# Altium schematic sheet PCIE_Connector.SchDoc: PCI Express GEN3  X 8 Connector
size B; DocumentNumber: 11; SheetNumber: 11; SheetTotal: 46
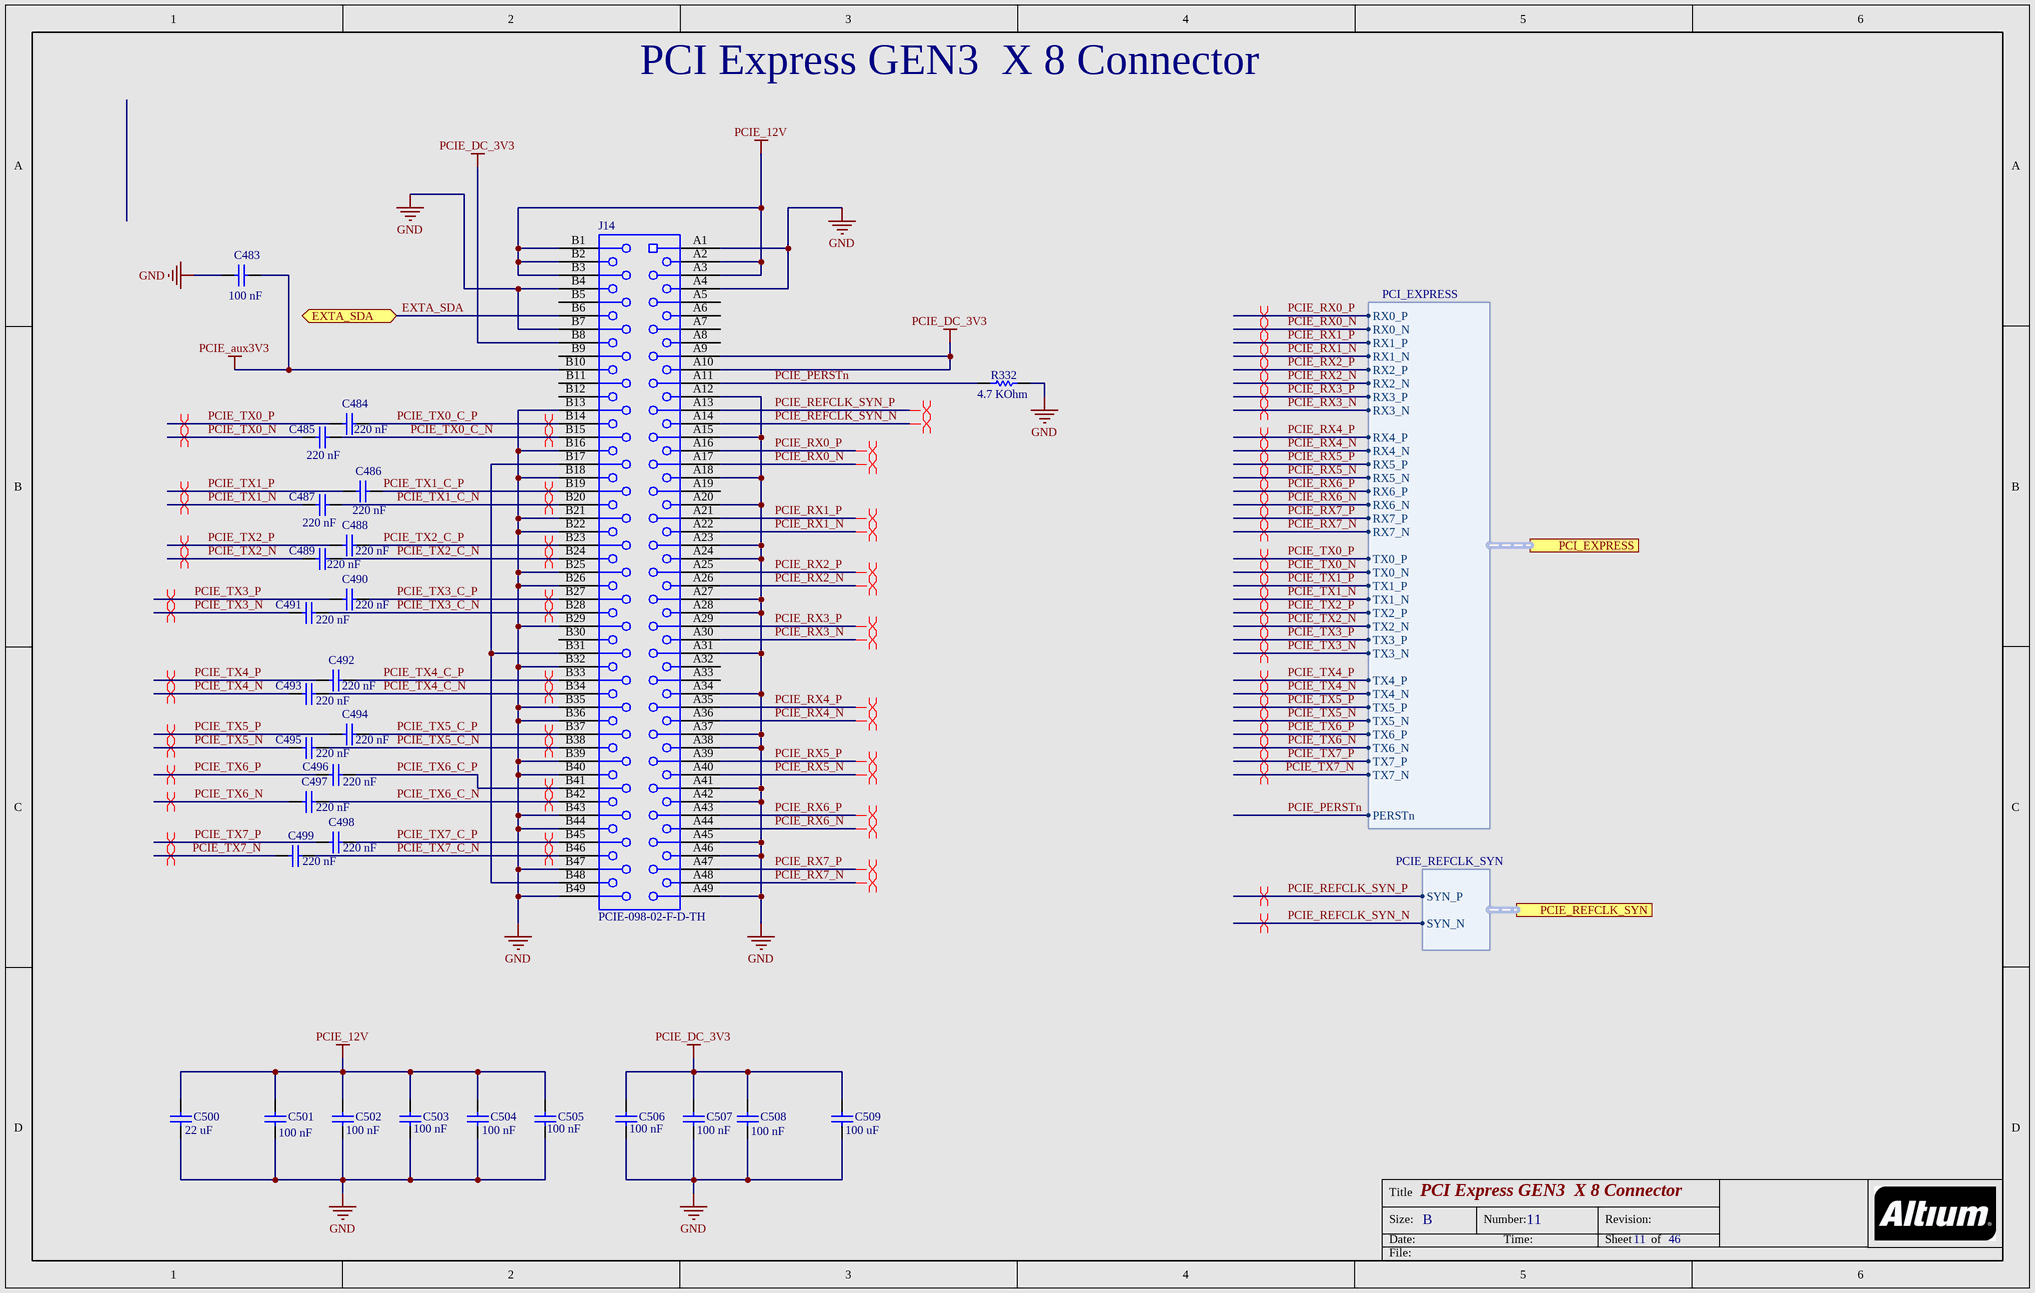
[diagram p0: PCIE_Connector.SchDoc]

## Parts
C483  Capacitance: 100 nF  [CAPC1005X55X10LL05]  (hidden comment: C1005X7R1E104M)
C484  Capacitance: 220 nF  [CAPC1005X55X25NL05T10]  (hidden comment: GRM155R61A224KE19D)
C485  Capacitance: 220 nF  [CAPC1005X55X25NL05T10]  (hidden comment: GRM155R61A224KE19D)
C486  Capacitance: 220 nF  [CAPC1005X55X25NL05T10]  (hidden comment: GRM155R61A224KE19D)
C487  Capacitance: 220 nF  [CAPC1005X55X25NL05T10]  (hidden comment: GRM155R61A224KE19D)
C488  Capacitance: 220 nF  [CAPC1005X55X25NL05T10]  (hidden comment: GRM155R61A224KE19D)
C489  Capacitance: 220 nF  [CAPC1005X55X25NL05T10]  (hidden comment: GRM155R61A224KE19D)
C490  Capacitance: 220 nF  [CAPC1005X55X25NL05T10]  (hidden comment: GRM155R61A224KE19D)
C491  Capacitance: 220 nF  [CAPC1005X55X25NL05T10]  (hidden comment: GRM155R61A224KE19D)
C492  Capacitance: 220 nF  [CAPC1005X55X25NL05T10]  (hidden comment: GRM155R61A224KE19D)
C493  Capacitance: 220 nF  [CAPC1005X55X25NL05T10]  (hidden comment: GRM155R61A224KE19D)
C494  Capacitance: 220 nF  [CAPC1005X55X25NL05T10]  (hidden comment: GRM155R61A224KE19D)
C495  Capacitance: 220 nF  [CAPC1005X55X25NL05T10]  (hidden comment: GRM155R61A224KE19D)
C496  Capacitance: 220 nF  [CAPC1005X55X25NL05T10]  (hidden comment: GRM155R61A224KE19D)
C497  Capacitance: 220 nF  [CAPC1005X55X25NL05T10]  (hidden comment: GRM155R61A224KE19D)
C498  Capacitance: 220 nF  [CAPC1005X55X25NL05T10]  (hidden comment: GRM155R61A224KE19D)
C499  Capacitance: 220 nF  [CAPC1005X55X25NL05T10]  (hidden comment: GRM155R61A224KE19D)
C500  Capacitance: 22 uF  [CAPC3216X180X55ML20T25]  (hidden comment: GRM31CR61E226KE15L)
C501  Capacitance: 100 nF  [CAPC1005X55X10LL05]  (hidden comment: C1005X7R1E104M)
C502  Capacitance: 100 nF  [CAPC1005X55X10LL05]  (hidden comment: C1005X7R1E104M)
C503  Capacitance: 100 nF  [CAPC1005X55X10LL05]  (hidden comment: C1005X7R1E104M)
C504  Capacitance: 100 nF  [CAPC1005X55X10LL05]  (hidden comment: C1005X7R1E104M)
C505  Capacitance: 100 nF  [CAPC1005X55X10LL05]  (hidden comment: C1005X7R1E104M)
C506  Capacitance: 100 nF  [CAPC1005X55X10LL05]  (hidden comment: C1005X7R1E104M)
C507  Capacitance: 100 nF  [CAPC1005X55X10LL05]  (hidden comment: C1005X7R1E104M)
C508  Capacitance: 100 nF  [CAPC1005X55X10LL05]  (hidden comment: C1005X7R1E104M)
C509  Capacitance: 100 uF  [CAPC3216X190X55ML30T25]  (hidden comment: GRM31CR60J107ME39L)
J14  PCIE-098-02-F-D-TH  [SMTC-PCIE-098-02-F-D-TH_V]
R332  Resistance: 4.7 KOhm  [RESC1005X40X25LL05T05]  (hidden comment: ERJ-2RKF4701X)

## Ports
EXTA_SDA (bidir), PCI_EXPRESS (harness PCI_EXPRESS), PCIE_REFCLK_SYN (harness PCIE_REFCLK_SYN)

## Harnesses
PCI_EXPRESS: RX0_P, RX0_N, RX1_P, RX1_N, RX2_P, RX2_N, RX3_P, RX3_N, RX7_N, RX7_P, RX4_P, RX4_N, RX5_P, RX5_N, RX6_P, RX6_N, TX0_P, TX0_N, TX1_P, TX1_N, TX2_P, TX2_N, TX3_P, TX3_N, TX7_N, TX7_P, TX4_P, TX4_N, TX5_P, TX5_N, TX6_P, TX6_N, PERSTn
PCIE_REFCLK_SYN: SYN_P, SYN_N

## Nets
GND: C483.1 C500.1 C501.1 C502.1 C503.1 C504.1 C505.1 C506.1 C507.1 C508.1 C509.1 J14.A1 J14.A4 J14.A12 J14.A15 J14.A18 J14.A20 J14.A23 J14.A24 J14.A27 J14.A28 J14.A31 J14.A34 J14.A37 J14.A38 J14.A41 J14.A42 J14.A45 J14.A46 J14.A49 J14.B4 J14.B7 J14.B13 J14.B16 J14.B18 J14.B21 J14.B22 J14.B25 J14.B26 J14.B29 J14.B32 J14.B35 J14.B36 J14.B39 J14.B40 J14.B43 J14.B44 J14.B47 J14.B49 R332.2
PCIE_12V: C500.2 C501.2 C502.2 C503.2 C504.2 C505.2 J14.A2 J14.A3 J14.B1 J14.B2 J14.B3
PCIE_aux3V3: C483.2 J14.B10
PCIE_DC_3V3: C506.2 C507.2 C508.2 C509.2 J14.A9 J14.A10 J14.B8
EXTA_SDA: J14.B6 ; port EXTA_SDA
PCIE_PERSTn: J14.A11 R332.1 ; port PCI_EXPRESS.PERSTn
PCIE_REFCLK_SYN_N: J14.A14 ; port PCIE_REFCLK_SYN.SYN_N
PCIE_REFCLK_SYN_P: J14.A13 ; port PCIE_REFCLK_SYN.SYN_P
PCIE_RX0_N: J14.A17 ; port PCI_EXPRESS.RX0_N
PCIE_RX0_P: J14.A16 ; port PCI_EXPRESS.RX0_P
PCIE_RX1_N: J14.A22 ; port PCI_EXPRESS.RX1_N
PCIE_RX1_P: J14.A21 ; port PCI_EXPRESS.RX1_P
PCIE_RX2_N: J14.A26 ; port PCI_EXPRESS.RX2_N
PCIE_RX2_P: J14.A25 ; port PCI_EXPRESS.RX2_P
PCIE_RX3_N: J14.A30 ; port PCI_EXPRESS.RX3_N
PCIE_RX3_P: J14.A29 ; port PCI_EXPRESS.RX3_P
PCIE_RX4_N: J14.A36 ; port PCI_EXPRESS.RX4_N
PCIE_RX4_P: J14.A35 ; port PCI_EXPRESS.RX4_P
PCIE_RX5_N: J14.A40 ; port PCI_EXPRESS.RX5_N
PCIE_RX5_P: J14.A39 ; port PCI_EXPRESS.RX5_P
PCIE_RX6_N: J14.A44 ; port PCI_EXPRESS.RX6_N
PCIE_RX6_P: J14.A43 ; port PCI_EXPRESS.RX6_P
PCIE_RX7_N: J14.A48 ; port PCI_EXPRESS.RX7_N
PCIE_RX7_P: J14.A47 ; port PCI_EXPRESS.RX7_P
PCIE_TX0_C_N: C485.2 J14.B15
PCIE_TX0_C_P: C484.2 J14.B14
PCIE_TX0_N: C485.1 ; port PCI_EXPRESS.TX0_N
PCIE_TX0_P: C484.1 ; port PCI_EXPRESS.TX0_P
PCIE_TX1_C_N: C487.2 J14.B20
PCIE_TX1_C_P: C486.2 J14.B19
PCIE_TX1_N: C487.1 ; port PCI_EXPRESS.TX1_N
PCIE_TX1_P: C486.1 ; port PCI_EXPRESS.TX1_P
PCIE_TX2_C_N: C489.2 J14.B24
PCIE_TX2_C_P: C488.2 J14.B23
PCIE_TX2_N: C489.1 ; port PCI_EXPRESS.TX2_N
PCIE_TX2_P: C488.1 ; port PCI_EXPRESS.TX2_P
PCIE_TX3_C_N: C491.2 J14.B28
PCIE_TX3_C_P: C490.2 J14.B27
PCIE_TX3_N: C491.1 ; port PCI_EXPRESS.TX3_N
PCIE_TX3_P: C490.1 ; port PCI_EXPRESS.TX3_P
PCIE_TX4_C_N: C493.2 J14.B34
PCIE_TX4_C_P: C492.2 J14.B33
PCIE_TX4_N: C493.1 ; port PCI_EXPRESS.TX4_N
PCIE_TX4_P: C492.1 ; port PCI_EXPRESS.TX4_P
PCIE_TX5_C_N: C495.2 J14.B38
PCIE_TX5_C_P: C494.2 J14.B37
PCIE_TX5_N: C495.1 ; port PCI_EXPRESS.TX5_N
PCIE_TX5_P: C494.1 ; port PCI_EXPRESS.TX5_P
PCIE_TX6_C_N: C497.2 J14.B42
PCIE_TX6_C_P: C496.2 J14.B41
PCIE_TX6_N: C497.1 ; port PCI_EXPRESS.TX6_N
PCIE_TX6_P: C496.1 ; port PCI_EXPRESS.TX6_P
PCIE_TX7_C_N: C499.2 J14.B46
PCIE_TX7_C_P: C498.2 J14.B45
PCIE_TX7_N: C499.1 ; port PCI_EXPRESS.TX7_N
PCIE_TX7_P: C498.1 ; port PCI_EXPRESS.TX7_P
NetJ14_B17: J14.B17 J14.B31 J14.B48

Not connected (* = marked no-connect by the designer): J14 A5 A6 A7 A8 A19 A32 A33 B5 B9 B11 B12 B30

## Layout directives
differential pair: PCIE_REFCLK_SYN_N, PCIE_REFCLK_SYN_P, PCIE_RX0_N, PCIE_RX0_P, PCIE_RX1_N, PCIE_RX1_P, PCIE_RX2_N, PCIE_RX2_P, PCIE_RX3_N, PCIE_RX3_P, PCIE_RX4_N, PCIE_RX4_P, PCIE_RX5_N, PCIE_RX5_P, PCIE_RX6_N, PCIE_RX6_P, PCIE_RX7_N, PCIE_RX7_P, PCIE_TX0_C_N, PCIE_TX0_C_P, PCIE_TX0_N, PCIE_TX0_P, PCIE_TX1_C_N, PCIE_TX1_C_P, PCIE_TX1_N, PCIE_TX1_P, PCIE_TX2_C_N, PCIE_TX2_C_P, PCIE_TX2_N, PCIE_TX2_P, PCIE_TX3_C_N, PCIE_TX3_C_P, PCIE_TX3_N, PCIE_TX3_P, PCIE_TX4_C_N, PCIE_TX4_C_P, PCIE_TX4_N, PCIE_TX4_P, PCIE_TX5_C_N, PCIE_TX5_C_P, PCIE_TX5_N, PCIE_TX5_P, PCIE_TX6_C_N, PCIE_TX6_C_P, PCIE_TX6_N, PCIE_TX6_P, PCIE_TX7_C_N, PCIE_TX7_C_P, PCIE_TX7_N, PCIE_TX7_P

## Notes on the sheet
- Title
- Size:
- Date:
- B
- Number:
- Time:
- Revision:
- Sheet
- of
- File:

## Library data of the parts
C483 C501-C508 = CMP-1663-00009-2: Chip Capacitor, 0.1 uF, +/- 20%, 25 V, -55 to 125 degC, 0402 (1005 Metric), RoHS, Tape and Reel; Type (Capacitors): X7R; Voltage Rating: 25 V; Case\/Package: 0402; Tolerance: 20%; Max Operating Temperature: 125 degC; ComponentLink2URL: http://www.farnell.com/datasheets/1571323.pdf; ComponentLink1URL: http://www.tdk.com/; RoHSCompliant: true; Packaging: Tape and Reel; Mounting Technology: Surface Mount; ComponentLink2Description: Datasheet; Case Code (Imperial): 0402; DatasheetVersion: 09/2011; ComponentLink1Description: Manufacturer URL; PackageDescription: 2-Pin Surface Mount Device, Body 1 x 0.5 mm; PackageReference: 0402; Min Operating Temperature: -55 degC; Case Code (Metric): 1005; Height: 0.5 mm; Package Quantity: 10000; Width: 0.5 mm; Pins: 2; Voltage Rating (DC): 25 V; PartNumber: C1005X7R1E104M; Mount: Surface Mount; Length: 1 mm
C484-C499 = CMP-2008-04561-4: Chip Capacitor, 220 nF, +/- 10%, 10 V, -55 to 85 degC, 0402 (1005 Metric), RoHS, Tape and Reel; Manufacturer: Basic Passives; Voltage Rating: 10 V; Case\/Package: 0402; Type (Capacitors): X5R; ComponentLink1URL: http://www.murata.com/; Package Quantity: 1; Tolerance: 10%; Mounting Technology: Surface Mount; RoHSCompliant: true; PartNumber: GRM155R61A224KE19D; Max Operating Temperature: 85 degC; Case Code (Imperial): 0402; Length: 1 mm; Packaging: Tape and Reel; Min Operating Temperature: -55 degC; PackageDescription: 2-Pin Surface Mount Device, Body 1 x 0.5 mm; Height: 0.5 mm; Case Code (Metric): 1005; REACH SVHC: No SVHC; ComponentLink1Description: Manufacturer URL; Width: 0.5 mm; ComponentLink2URL: http://search.murata.co.jp/Ceramy/image/img/A01X/G101/ENG/GRM155R61A224KE19-01.pdf; Radiation Hardening: No; Pins: 2; Voltage Rating (DC): 10 V; DatasheetVersion: 03/2016; Mount: Surface Mount; PackageReference: 0402; ComponentLink2Description: Datasheet
C500 = CMP-1662-00010-2: Chip Capacitor, 22 uF, +/- 10%, 25 V, -55 to 85 degC, 1206 (3216 Metric), RoHS, Tape and Reel; Voltage Rating (DC): 25 V; Case\/Package: 1206; Type (Capacitors): X5R; Tolerance: 10%; Max Operating Temperature: 85 degC; Package Quantity: 2000; Voltage Rating: 25 V; Case Code (Metric): 3216; Length: 3.2 mm; PackageDescription: 2-Pin Surface Mount Device, Body 3.2 x 1.6 mm; ComponentLink1Description: Manufacturer URL; Case Code (Imperial): 1206; ComponentLink1URL: http://www.murata.com/; Radiation Hardening: No; Height: 1.6 mm; Width: 1.6 mm; DatasheetVersion: 03/2016; Min Operating Temperature: -55 degC; Mount: Surface Mount; REACH SVHC: No SVHC; PackageReference: 1206; ComponentLink2URL: http://search.murata.co.jp/Ceramy/image/img/A01X/G101/ENG/GRM31CR61E226KE15-01.pdf; Packaging: Tape and Reel; RoHSCompliant: true; ComponentLink2Description: Datasheet; Mounting Technology: Surface Mount; PartNumber: GRM31CR61E226KE15L; Pins: 2
C509 = CMP-1662-00011-2: Chip Capacitor, 100 uF, +/- 20%, 6.3 V, -55 to 85 degC, 1206 (3216 Metric), RoHS, Tape and Reel; Voltage Rating: 6.3 V; Type (Capacitors): X5R; Case\/Package: 1206; Tolerance: 20%; ComponentLink1URL: http://www.murata.com/; ComponentLink1Description: Manufacturer URL; PackageDescription: 2-Pin Surface Mount Device, Body 3.2 x 1.6 mm; Max Operating Temperature: 85 degC; Case Code (Imperial): 1206; PackageReference: 1206; Height: 1.6 mm; Width: 1.6 mm; Packaging: Tape and Reel; DatasheetVersion: 09/2016; REACH SVHC: No SVHC; Mounting Technology: Surface Mount; Case Code (Metric): 3216; Min Operating Temperature: -55 degC; RoHSCompliant: true; Radiation Hardening: No; Voltage Rating (DC): 6.3 V; Package Quantity: 2000; ComponentLink2Description: Datasheet; Mount: Surface Mount; Length: 3.2 mm; ComponentLink2URL: http://psearch.en.murata.com/capacitor/product/GRM31CR60J107ME39%23.pdf; Pins: 2; PartNumber: GRM31CR60J107ME39L
J14 = CMP-1707-00002-1: Female Header, Pitch 1 mm, 98 Positions, 4 Rows, Height 11 mm, Tail Length 2.31 mm, -55 to 125 degC, RoHS; Manufacturer: Samtec; PartNumber: PCIE-098-02-F-D-TH; PackageReference: PCIE-098-02-F-D-TH; ComponentLink3URL: http://suddendocs.samtec.com/prints/pcie-xxx-02-x-d-th-footprint.pdf; PackageDescription: Female Header, Pitch 1 mm, 98 Positions, 4 Rows, Height 11 mm, Tail Length 2.31 mm; ComponentLink2Description: Datasheet; ComponentLink1URL: http://www.samtec.com/; Mounting Technology: Through Hole; DatasheetVersion: Rev. 21JAN16; ComponentLink2URL: http://suddendocs.samtec.com/catalog_english/pcie.pdf; ComponentLink1Description: Manufacturer URL; ComponentLink3Description: Package Specification
R332 = CMP-1665-00031-3: Chip Resistor, 4.7 KOhm, +/- 1%, 0.1 W, -55 to 155 degC, 0402 (1005 Metric), RoHS, Tape and Reel; Voltage Rating: 50 V; Case\/Package: 0402; Power Rating: 100 mW; Tolerance: 1%; Case Code (Imperial): 0402; PartNumber: ERJ-2RKF4701X; Mounting Technology: Surface Mount; ComponentLink1Description: Manufacturer URL; Width: 0.5 mm; DatasheetVersion: 04/2015; PackageDescription: 2-Pin Surface Mount Device, Body 1 x 0.5 mm; ComponentLink2Description: Datasheet; Packaging: Cut Tape; RoHSCompliant: true; Package Quantity: 1; Height: 0.35 mm; REACH SVHC: Yes; Case Code (Metric): 1005; Max Operating Temperature: 155 degC; ComponentLink1URL: http://www.panasonic.com/; Radiation Hardening: No; ComponentLink2URL: http://industrial.panasonic.com/cdbs/www-data/pdf/RDA0000/AOA0000C86.pdf; Min Operating Temperature: -55 degC; Length: 1 mm; Pins: 2; PackageReference: 0402; Mount: Surface Mount